# Altium schematic sheet STM32_F407.SchDoc
size A2
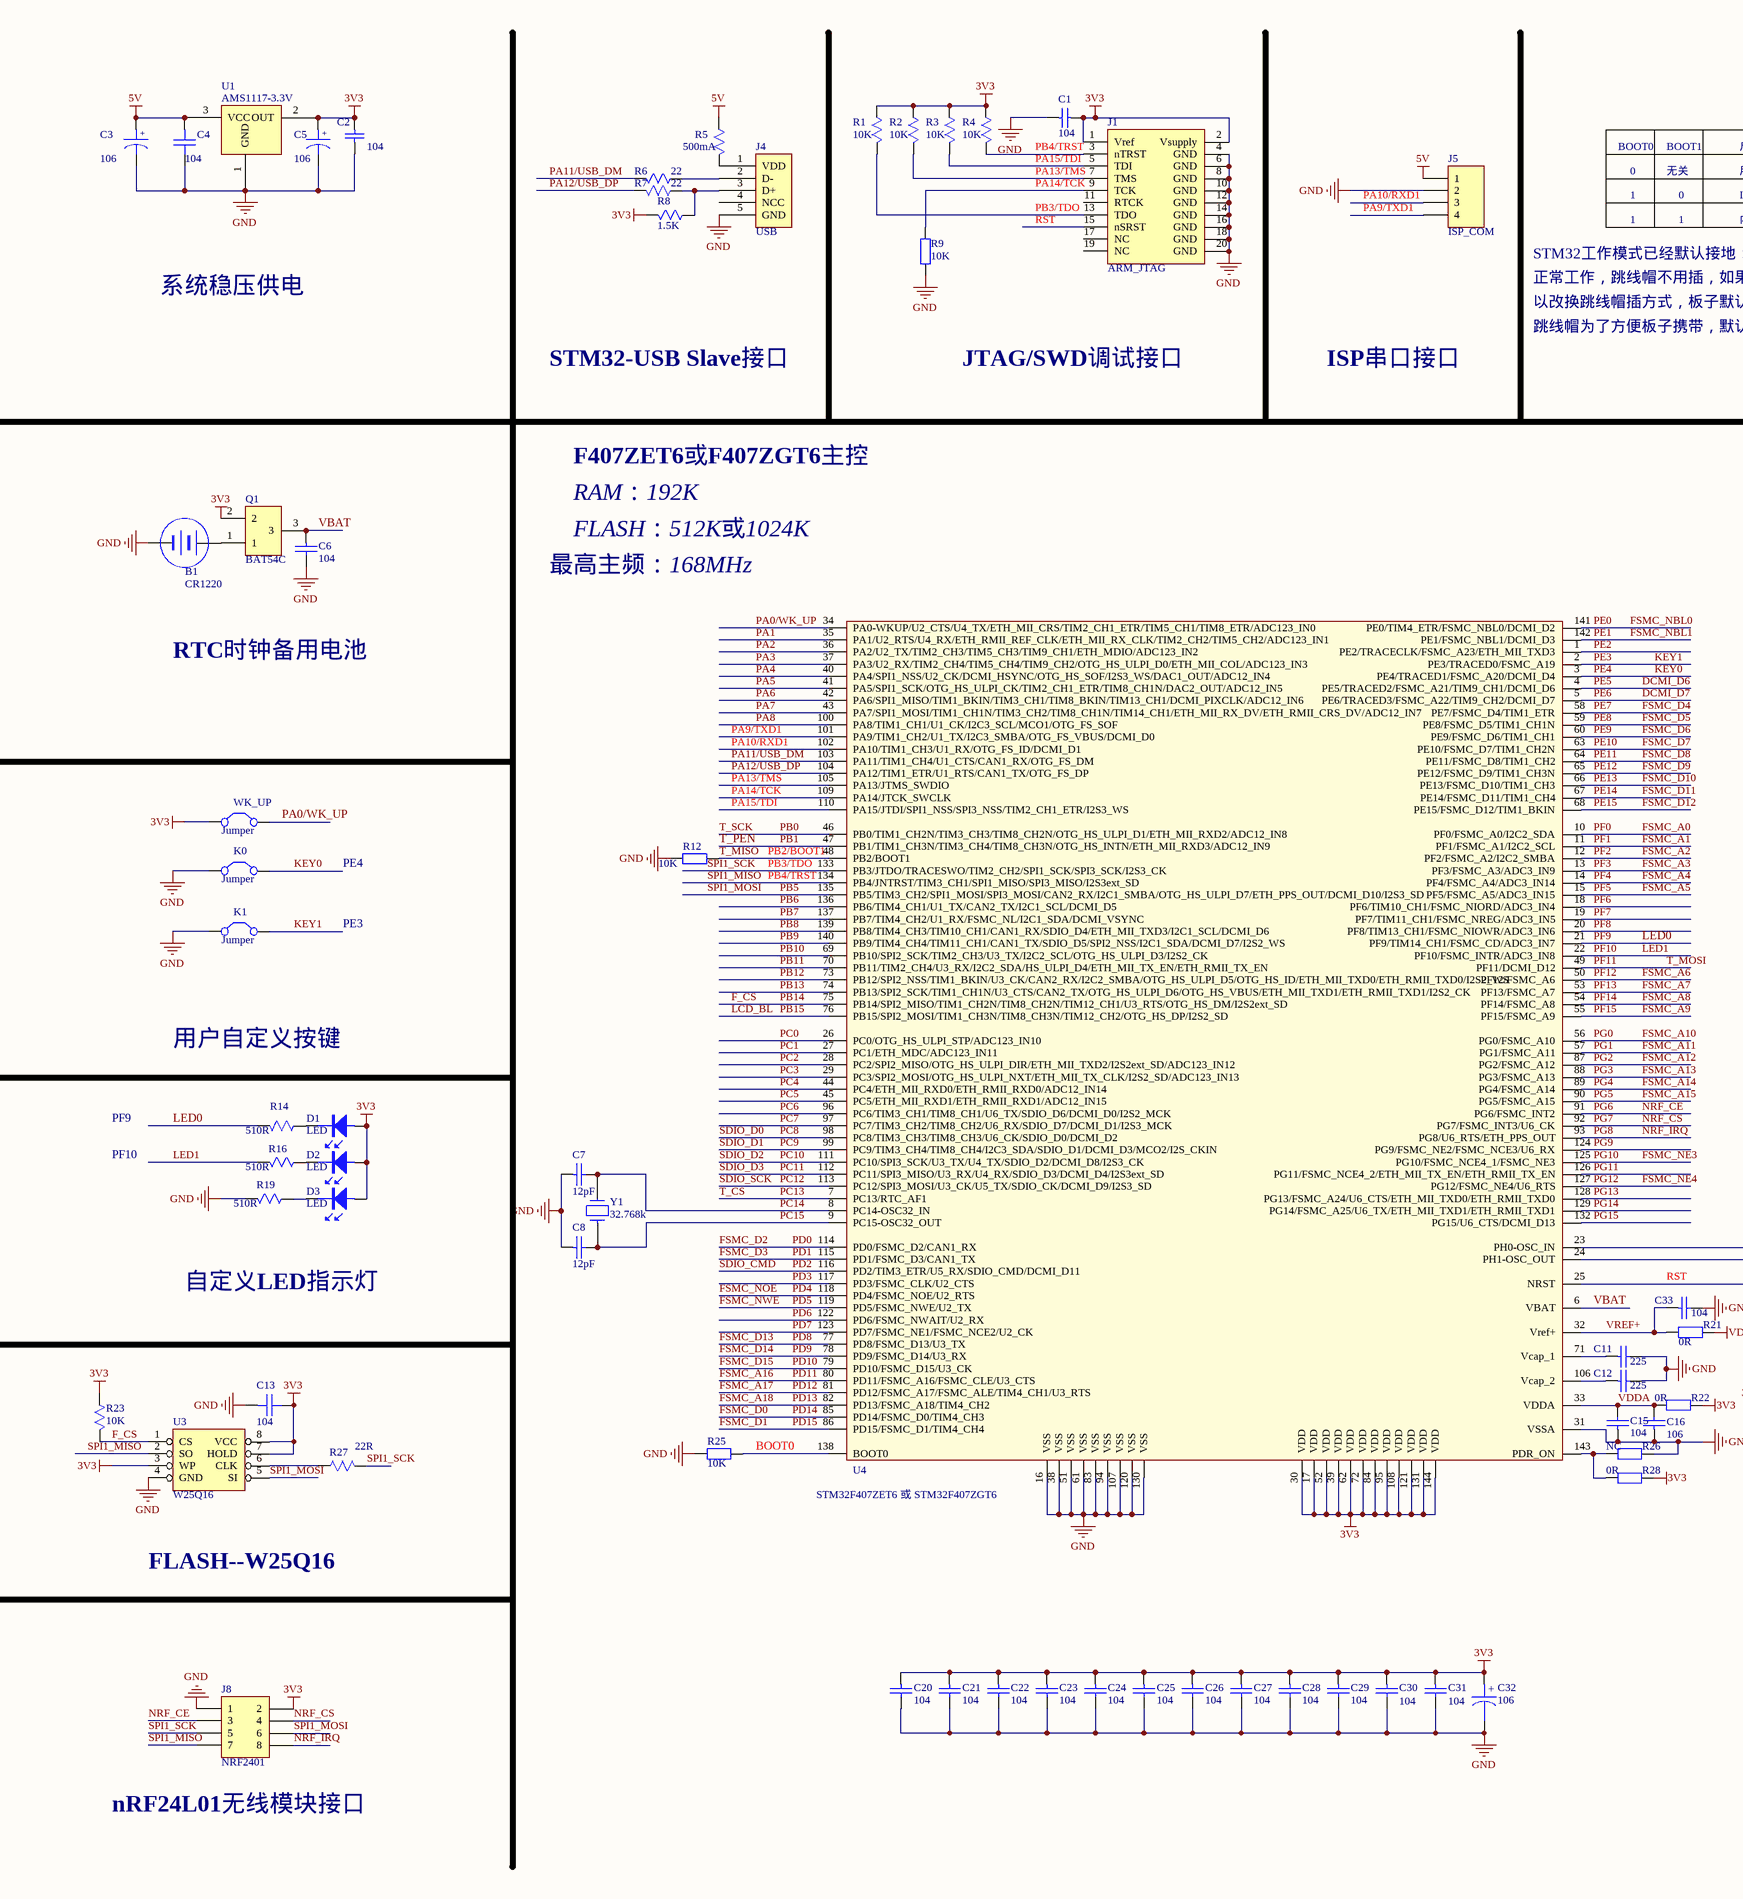
[diagram p0: STM32_F407.SchDoc, left]
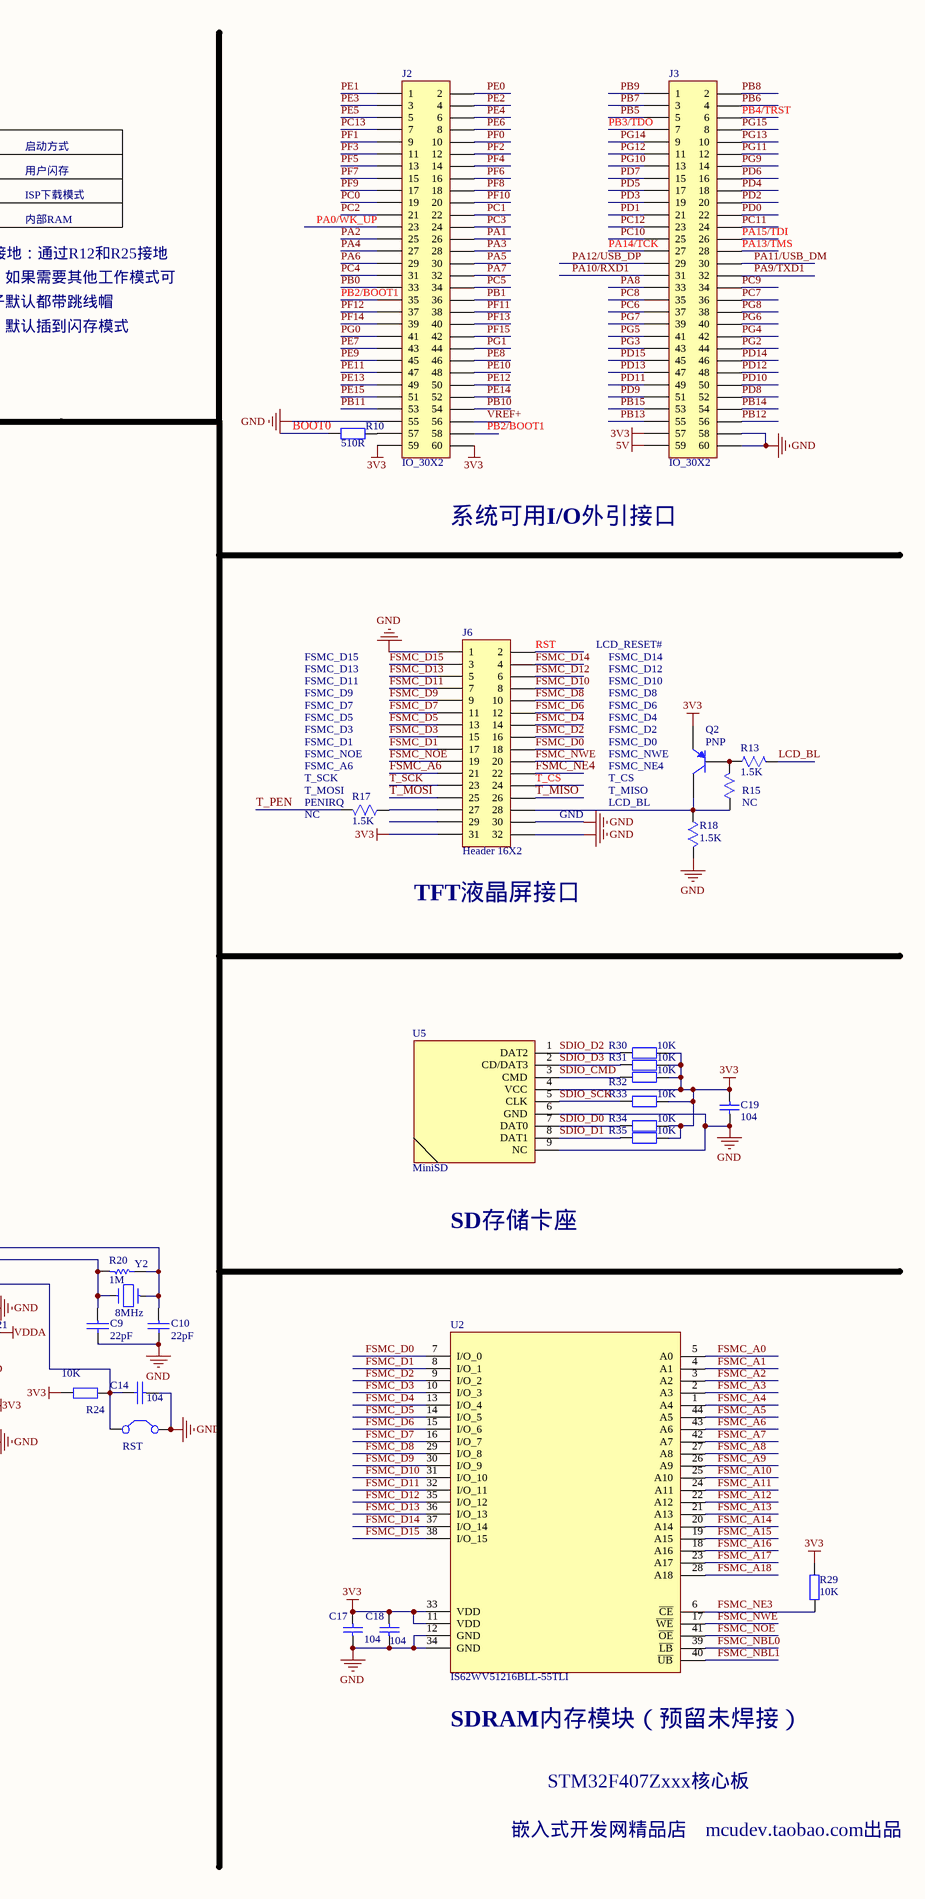
[diagram p1: STM32_F407.SchDoc, right]

## Parts
B1  CR1220  [CP1220]
C1  104  [RC0603]
C2  104  [RC0603]
C3  106  [RC0805]
C4  104  [RC0603]
C5  106  [RC0805]
C6  104  [RC0603]
C7  12pF  [RC0603]
C8  12pF  [RC0603]
C9  22pF  [RC0603]
C10  22pF  [RC0603]
C11  225  [RC0805]
C12  225  [RC0805]
C13  104  [RC0603]
C14  104  [RC0603]
C15  104  [RC0603]
C16  106  [RC0805]
C17  104  [RC0603]
C18  104  [RC0603]
C19  104  [RC0603]
C20  104  [RC0603]
C21  104  [RC0603]
C22  104  [RC0603]
C23  104  [RC0603]
C24  104  [RC0603]
C25  104  [RC0603]
C26  104  [RC0603]
C27  104  [RC0603]
C28  104  [RC0603]
C29  104  [RC0603]
C30  104  [RC0603]
C31  104  [RC0603]
C32  106  [RC0805]
C33  104  [RC0603]
D1  LED  [LED0805]
D2  LED  [LED0805]
D3  LED  [LED0805]
J1  ARM_JTAG  [JTAG20P]
J2  IO_30X2  [IDE2X30]
J3  IO_30X2  [IDE2X30]
J4  USB  [MINUSB]
J5  ISP_COM  [HDR1X4]
J6  Header 16X2  [IDE2X16-2.54]
J8  NRF2401  [DIP2X4-2.54]
K0  Jumper  [key]
K1  Jumper  [key]
Q1  BAT54C  [BAT54C]
Q2  PNP  [PNP_SOT23]
R1  10K  [RC0603]
R2  10K  [RC0603]
R3  10K  [RC0603]
R4  10K  [RC0603]
R5  500mA  [RC0805]
R6  22  [RC0603]
R7  22  [RC0603]
R8  1.5K  [RC0603]
R9  10K  [RC0603]
R10  510R  [RC0603]
R12  10K  [RC0603]
R13  1.5K  [RC0603]
R14  510R  [RC0603]
R15  NC  [RC0603]
R16  510R  [RC0603]
R17  1.5K  [RC0603]
R18  1.5K  [RC0603]
R19  510R  [RC0603]
R20  1M  [RC0603]
R21  0R  [RC0603]
R22  0R  [RC0603]
R23  10K  [RC0603]
R24  10K  [RC0603]
R25  10K  [RC0603]
R26  NC  [RC0603]
R27  22R  [RC0603]
R28  0R  [RC0603]
R29  10K  [RC0603]
R30  10K  [RC0603]
R31  10K  [RC0603]
R32  10K  [RC0603]
R33  10K  [RC0603]
R34  10K  [RC0603]
R35  10K  [RC0603]
RST  Key  [key]  (value not drawn)
U1  AMS1117-3.3V  [SOT223]
U2  IS62WV51216BLL-55TLI  [TSOP44]
U3  W25Q16  [SOIC8P]
U4  STM32F407ZET6 或 STM32F407ZGT6  [LQFP144N]
U5  MiniSD  [TF_SD]
WK_UP  Jumper  [key]
Y1  32.768k  [32.768k]
Y2  8MHz  [SMD49S]

## Nets
3V3: C1.2 C2.1 C5.1 C13.2 C17.2 C18.2 C19.1 C20.1 C21.1 C22.1 C23.1 C24.1 C25.1 C26.1 C27.1 C28.1 C29.1 C30.1 C31.1 C32.1 D1.1 D2.1 D3.1 J1.1(Vref) J1.2(Vsupply) J2.59 J2.60 J3.57 J6.31 J8.2 Q1.2 Q2.2(E) R1.1 R2.1 R3.1 R4.1 R8.2 R22.2 R23.1 R24.2 R28.2 R29.2 R30.2 R31.2 R32.2 R33.2 R34.2 R35.2 U1.2(OUT) U2.11(VDD) U2.33(VDD) U3.3(WP) U3.7(HOLD) U3.8(VCC) U4.17(VDD) U4.30(VDD) U4.39(VDD) U4.52(VDD) U4.62(VDD) U4.72(VDD) U4.84(VDD) U4.95(VDD) U4.108(VDD) U4.121(VDD) U4.131(VDD) U4.144(VDD) U5.4(VCC) WK_UP.1(C1)
5V: C3.1 C4.1 J3.59 J5.1 R5.1 U1.3(VCC)
GND: B1.2(-) C1.1 C2.2 C3.2 C4.2 C5.2 C6.2 C7.1 C8.1 C9.2 C10.2 C11.2 C12.2 C13.1 C14.1 C15.1 C16.1 C17.1 C18.1 C19.2 C20.2 C21.2 C22.2 C23.2 C24.2 C25.2 C26.2 C27.2 C28.2 C29.2 C30.2 C31.2 C32.2 C33.2 J1.4(GND) J1.6(GND) J1.8(GND) J1.10(GND) J1.12(GND) J1.14(GND) J1.16(GND) J1.18(GND) J1.20(GND) J2.55 J3.58 J3.60 J4.5(GND) J5.2 J6.1 J6.30 J6.32 J8.1 K0.1(C1) K1.1(C1) R9.1 R12.2 R18.2 R19.2 R25.2 R26.2 RST.2(C2) U1.1(GND) U2.12(GND) U2.34(GND) U3.4(GND) U4.16(VSS) U4.31(VSSA) U4.38(VSS) U4.51(VSS) U4.61(VSS) U4.83(VSS) U4.94(VSS) U4.107(VSS) U4.120(VSS) U4.130(VSS) U5.6(GND) U5.9(NC)
VDDA: C15.2 C16.2 R21.2 R22.1 U4.33(VDDA)
BOOT0: R10.2 R25.1 U4.138(BOOT0)
DCMI_D6: J2.5 U4.4(PE5/TRACED2/FSMC_A21/TIM9_CH1/DCMI_D6)  [also labelled PE5]
DCMI_D7: J2.8 U4.5(PE6/TRACED3/FSMC_A22/TIM9_CH2/DCMI_D7)  [also labelled PE6]
F_CS: J3.54 R23.2 U3.1(CS) U4.75(PB14/SPI2_MISO/TIM1_CH2N/TIM8_CH2N/TIM12_CH1/U3_RTS/OTG_HS_DM/I2S2ext_SD)  [also labelled PB14]
FSMC_A0: J2.10 U2.5(A0) U4.10(PF0/FSMC_A0/I2C2_SDA)  [also labelled PF0]
FSMC_A1: J2.9 U2.4(A1) U4.11(PF1/FSMC_A1/I2C2_SCL)  [also labelled PF1]
FSMC_A2: J2.12 U2.3(A2) U4.12(PF2/FSMC_A2/I2C2_SMBA)  [also labelled PF2]
FSMC_A3: J2.11 U2.2(A3) U4.13(PF3/FSMC_A3/ADC3_IN9)  [also labelled PF3]
FSMC_A4: J2.14 U2.1(A4) U4.14(PF4/FSMC_A4/ADC3_IN14)  [also labelled PF4]
FSMC_A5: J2.13 U2.44(A5) U4.15(PF5/FSMC_A5/ADC3_IN15)  [also labelled PF5]
FSMC_A6: J2.37 J6.21 U2.43(A6) U4.50(PF12/FSMC_A6)  [also labelled PF12]
FSMC_A7: J2.40 U2.42(A7) U4.53(PF13/FSMC_A7)  [also labelled PF13]
FSMC_A8: J2.39 U2.27(A8) U4.54(PF14/FSMC_A8)  [also labelled PF14]
FSMC_A9: J2.42 U2.26(A9) U4.55(PF15/FSMC_A9)  [also labelled PF15]
FSMC_A10: J2.41 U2.25(A10) U4.56(PG0/FSMC_A10)  [also labelled PG0]
FSMC_A11: J2.44 U2.24(A11) U4.57(PG1/FSMC_A11)  [also labelled PG1]
FSMC_A12: J3.44 U2.22(A12) U4.87(PG2/FSMC_A12)  [also labelled PG2]
FSMC_A13: J3.43 U2.21(A13) U4.88(PG3/FSMC_A13)  [also labelled PG3]
FSMC_A14: J3.42 U2.20(A14) U4.89(PG4/FSMC_A14)  [also labelled PG4]
FSMC_A15: J3.41 U2.19(A15) U4.90(PG5/FSMC_A15)  [also labelled PG5]
FSMC_A16: J3.49 U2.18(A16) U4.80(PD11/FSMC_A16/FSMC_CLE/U3_CTS)  [also labelled PD11]
FSMC_A17: J3.48 U2.23(A17) U4.81(PD12/FSMC_A17/FSMC_ALE/TIM4_CH1/U3_RTS)  [also labelled PD12]
FSMC_A18: J3.47 U2.28(A18) U4.82(PD13/FSMC_A18/TIM4_CH2)  [also labelled PD13]
FSMC_D0: J3.46 J6.18 U2.7(I/O_0) U4.85(PD14/FSMC_D0/TIM4_CH3)  [also labelled PD14]
FSMC_D1: J3.45 J6.17 U2.8(I/O_1) U4.86(PD15/FSMC_D1/TIM4_CH4)  [also labelled PD15]
FSMC_D2: J3.22 J6.16 U2.9(I/O_2) U4.114(PD0/FSMC_D2/CAN1_RX)  [also labelled PD0]
FSMC_D3: J3.21 J6.15 U2.10(I/O_3) U4.115(PD1/FSMC_D3/CAN1_TX)  [also labelled PD1]
FSMC_D4: J2.43 J6.14 U2.13(I/O_4) U4.58(PE7/FSMC_D4/TIM1_ETR)  [also labelled PE7]
FSMC_D5: J2.46 J6.13 U2.14(I/O_5) U4.59(PE8/FSMC_D5/TIM1_CH1N)  [also labelled PE8]
FSMC_D6: J2.45 J6.12 U2.15(I/O_6) U4.60(PE9/FSMC_D6/TIM1_CH1)  [also labelled PE9]
FSMC_D7: J2.48 J6.11 U2.16(I/O_7) U4.63(PE10/FSMC_D7/TIM1_CH2N)  [also labelled PE10]
FSMC_D8: J2.47 J6.10 U2.29(I/O_8) U4.64(PE11/FSMC_D8/TIM1_CH2)  [also labelled PE11]
FSMC_D9: J2.50 J6.9 U2.30(I/O_9) U4.65(PE12/FSMC_D9/TIM1_CH3N)  [also labelled PE12]
FSMC_D10: J2.49 J6.8 U2.31(I/O_10) U4.66(PE13/FSMC_D10/TIM1_CH3)  [also labelled PE13]
FSMC_D11: J2.52 J6.7 U2.32(I/O_11) U4.67(PE14/FSMC_D11/TIM1_CH4)  [also labelled PE14]
FSMC_D12: J2.51 J6.6 U2.35(I/O_12) U4.68(PE15/FSMC_D12/TIM1_BKIN)  [also labelled PE15]
FSMC_D13: J3.52 J6.5 U2.36(I/O_13) U4.77(PD8/FSMC_D13/U3_TX)  [also labelled PD8]
FSMC_D14: J3.51 J6.4 U2.37(I/O_14) U4.78(PD9/FSMC_D14/U3_RX)  [also labelled PD9]
FSMC_D15: J3.50 J6.3 U2.38(I/O_15) U4.79(PD10/FSMC_D15/U3_CK)  [also labelled PD10]
FSMC_NBL0: J2.2 U2.39(~{LB}) U4.141(PE0/TIM4_ETR/FSMC_NBL0/DCMI_D2)  [also labelled PE0]
FSMC_NBL1: J2.1 U2.40(~{UB}) U4.142(PE1/FSMC_NBL1/DCMI_D3)  [also labelled PE1]
FSMC_NE3: J3.13 R29.1 U2.6(~{CE}) U4.125(PG10/FSMC_NCE4_1/FSMC_NE3)  [also labelled PG10]
FSMC_NE4: J3.11 J6.22 U4.127(PG12/FSMC_NE4/U6_RTS)  [also labelled PG12]
FSMC_NOE: J3.18 J6.19 U2.41(~{OE}) U4.118(PD4/FSMC_NOE/U2_RTS)  [also labelled PD4]
FSMC_NWE: J3.17 J6.20 U2.17(~{WE}) U4.119(PD5/FSMC_NWE/U2_TX)  [also labelled PD5]
KEY0: J2.6 K0.2(C2) U4.3(PE4/TRACED1/FSMC_A20/DCMI_D4)  [also labelled PE4]
KEY1: J2.3 K1.2(C2) U4.2(PE3/TRACED0/FSMC_A19)  [also labelled PE3]
LCD_BL: J3.53 R13.2 U4.76(PB15/SPI2_MOSI/TIM1_CH3N/TIM8_CH3N/TIM12_CH2/OTG_HS_DP/I2S2_SD)  [also labelled PB15]
LED0: J2.17 R14.2 U4.21(PF9/TIM14_CH1/FSMC_CD/ADC3_IN7)  [also labelled PF9]
LED1: J2.20 R16.2 U4.22(PF10/FSMC_INTR/ADC3_IN8)  [also labelled PF10]
NRF_CE: J3.40 J8.3 U4.91(PG6/FSMC_INT2)  [also labelled PG6]
NRF_CS: J3.39 J8.4 U4.92(PG7/FSMC_INT3/U6_CK)  [also labelled PG7]
NRF_IRQ: J3.38 J8.8 U4.93(PG8/U6_RTS/ETH_PPS_OUT)  [also labelled PG8]
PA0/WK_UP: J2.23 U4.34(PA0-WKUP/U2_CTS/U4_TX/ETH_MII_CRS/TIM2_CH1_ETR/TIM5_CH1/TIM8_ETR/ADC123_IN0) WK_UP.2(C2)
PA1: J2.26 U4.35(PA1/U2_RTS/U4_RX/ETH_RMII_REF_CLK/ETH_MII_RX_CLK/TIM2_CH2/TIM5_CH2/ADC123_IN1)
PA2: J2.25 U4.36(PA2/U2_TX/TIM2_CH3/TIM5_CH3/TIM9_CH1/ETH_MDIO/ADC123_IN2)
PA3: J2.28 U4.37(PA3/U2_RX/TIM2_CH4/TIM5_CH4/TIM9_CH2/OTG_HS_ULPI_D0/ETH_MII_COL/ADC123_IN3)
PA4: J2.27 U4.40(PA4/SPI1_NSS/U2_CK/DCMI_HSYNC/OTG_HS_SOF/I2S3_WS/DAC1_OUT/ADC12_IN4)
PA5: J2.30 U4.41(PA5/SPI1_SCK/OTG_HS_ULPI_CK/TIM2_CH1_ETR/TIM8_CH1N/DAC2_OUT/ADC12_IN5)
PA6: J2.29 U4.42(PA6/SPI1_MISO/TIM1_BKIN/TIM3_CH1/TIM8_BKIN/TIM13_CH1/DCMI_PIXCLK/ADC12_IN6)
PA7: J2.32 U4.43(PA7/SPI1_MOSI/TIM1_CH1N/TIM3_CH2/TIM8_CH1N/TIM14_CH1/ETH_MII_RX_DV/ETH_RMII_CRS_DV/ADC12_IN7)
PA8: J3.33 U4.100(PA8/TIM1_CH1/U1_CK/I2C3_SCL/MCO1/OTG_FS_SOF)
PA9/TXD1: J3.32 J5.4 U4.101(PA9/TIM1_CH2/U1_TX/I2C3_SMBA/OTG_FS_VBUS/DCMI_D0)
PA10/RXD1: J3.31 J5.3 U4.102(PA10/TIM1_CH3/U1_RX/OTG_FS_ID/DCMI_D1)
PA11/USB_DM: J3.30 R6.2 U4.103(PA11/TIM1_CH4/U1_CTS/CAN1_RX/OTG_FS_DM)
PA12/USB_DP: J3.29 R7.2 U4.104(PA12/TIM1_ETR/U1_RTS/CAN1_TX/OTG_FS_DP)
PA13/TMS: J1.7(TMS) J3.28 R2.2 U4.105(PA13/JTMS_SWDIO)
PA14/TCK: J1.9(TCK) J3.27 R9.2 U4.109(PA14/JTCK_SWCLK)
PA15/TDI: J1.5(TDI) J3.26 R3.2 U4.110(PA15/JTDI/SPI1_NSS/SPI3_NSS/TIM2_CH1_ETR/I2S3_WS)
PB0: J2.33 J6.23 U4.46(PB0/TIM1_CH2N/TIM3_CH3/TIM8_CH2N/OTG_HS_ULPI_D1/ETH_MII_RXD2/ADC12_IN8)  [also labelled T_SCK]
PB1: J2.36 R17.2 U4.47(PB1/TIM1_CH3N/TIM3_CH4/TIM8_CH3N/OTG_HS_INTN/ETH_MII_RXD3/ADC12_IN9)  [also labelled T_PEN]
PB2/BOOT1: J2.35 J2.58 J6.26 R12.1 U4.48(PB2/BOOT1)  [also labelled T_MISO]
PB3/TDO: J1.13(TDO) J3.7 J8.5 R1.2 R27.2 U4.133(PB3/JTDO/TRACESWO/TIM2_CH2/SPI1_SCK/SPI3_SCK/I2S3_CK)  [also labelled SPI1_SCK]
PB4/TRST: J1.3(nTRST) J3.6 J8.7 R4.2 U3.2(SO) U4.134(PB4/JNTRST/TIM3_CH1/SPI1_MISO/SPI3_MISO/I2S3ext_SD)  [also labelled SPI1_MISO]
PB5: J3.5 J8.6 U3.5(SI) U4.135(PB5/TIM3_CH2/SPI1_MOSI/SPI3_MOSI/CAN2_RX/I2C1_SMBA/OTG_HS_ULPI_D7/ETH_PPS_OUT/DCMI_D10/I2S3_SD)  [also labelled SPI1_MOSI]
PB6: J3.4 U4.136(PB6/TIM4_CH1/U1_TX/CAN2_TX/I2C1_SCL/DCMI_D5)
PB7: J3.3 U4.137(PB7/TIM4_CH2/U1_RX/FSMC_NL/I2C1_SDA/DCMI_VSYNC)
PB8: J3.2 U4.139(PB8/TIM4_CH3/TIM10_CH1/CAN1_RX/SDIO_D4/ETH_MII_TXD3/I2C1_SCL/DCMI_D6)
PB9: J3.1 U4.140(PB9/TIM4_CH4/TIM11_CH1/CAN1_TX/SDIO_D5/SPI2_NSS/I2C1_SDA/DCMI_D7/I2S2_WS)
PB10: J2.54 U4.69(PB10/SPI2_SCK/TIM2_CH3/U3_TX/I2C2_SCL/OTG_HS_ULPI_D3/I2S2_CK)
PB11: J2.53 U4.70(PB11/TIM2_CH4/U3_RX/I2C2_SDA/HS_ULPI_D4/ETH_MII_TX_EN/ETH_RMII_TX_EN)
PB12: J3.56 U4.73(PB12/SPI2_NSS/TIM1_BKIN/U3_CK/CAN2_RX/I2C2_SMBA/OTG_HS_ULPI_D5/OTG_HS_ID/ETH_MII_TXD0/ETH_RMII_TXD0/I2S2_WS)
PB13: J3.55 U4.74(PB13/SPI2_SCK/TIM1_CH1N/U3_CTS/CAN2_TX/OTG_HS_ULPI_D6/OTG_HS_VBUS/ETH_MII_TXD1/ETH_RMII_TXD1/I2S2_CK)
PC0: J2.19 U4.26(PC0/OTG_HS_ULPI_STP/ADC123_IN10)
PC1: J2.22 U4.27(PC1/ETH_MDC/ADC123_IN11)
PC2: J2.21 U4.28(PC2/SPI2_MISO/OTG_HS_ULPI_DIR/ETH_MII_TXD2/I2S2ext_SD/ADC123_IN12)
PC3: J2.24 U4.29(PC3/SPI2_MOSI/OTG_HS_ULPI_NXT/ETH_MII_TX_CLK/I2S2_SD/ADC123_IN13)
PC4: J2.31 U4.44(PC4/ETH_MII_RXD0/ETH_RMII_RXD0/ADC12_IN14)
PC5: J2.34 U4.45(PC5/ETH_MII_RXD1/ETH_RMII_RXD1/ADC12_IN15)
PC6: J3.37 U4.96(PC6/TIM3_CH1/TIM8_CH1/U6_TX/SDIO_D6/DCMI_D0/I2S2_MCK)
PC7: J3.36 U4.97(PC7/TIM3_CH2/TIM8_CH2/U6_RX/SDIO_D7/DCMI_D1/I2S3_MCK)
PC8: J3.35 R34.1 U4.98(PC8/TIM3_CH3/TIM8_CH3/U6_CK/SDIO_D0/DCMI_D2) U5.7(DAT0)  [also labelled SDIO_D0]
PC9: J3.34 R35.1 U4.99(PC9/TIM3_CH4/TIM8_CH4/I2C3_SDA/SDIO_D1/DCMI_D3/MCO2/I2S_CKIN) U5.8(DAT1)  [also labelled SDIO_D1]
PC10: J3.25 R30.1 U4.111(PC10/SPI3_SCK/U3_TX/U4_TX/SDIO_D2/DCMI_D8/I2S3_CK) U5.1(DAT2)  [also labelled SDIO_D2]
PC11: J3.24 R31.1 U4.112(PC11/SPI3_MISO/U3_RX/U4_RX/SDIO_D3/DCMI_D4/I2S3ext_SD) U5.2(CD/DAT3)  [also labelled SDIO_D3]
PC12: J3.23 R33.1 U4.113(PC12/SPI3_MOSI/U3_CK/U5_TX/SDIO_CK/DCMI_D9/I2S3_SD) U5.5(CLK)  [also labelled SDIO_SCK]
PC13: J2.7 J6.24 U4.7(PC13/RTC_AF1)  [also labelled T_CS]
PC14: C7.2 U4.8(PC14-OSC32_IN) Y1.2
PC15: C8.2 U4.9(PC15-OSC32_OUT) Y1.1
PD2: J3.20 R32.1 U4.116(PD2/TIM3_ETR/U5_RX/SDIO_CMD/DCMI_D11) U5.3(CMD)  [also labelled SDIO_CMD]
PD3: J3.19 U4.117(PD3/FSMC_CLK/U2_CTS)
PD6: J3.16 U4.122(PD6/FSMC_NWAIT/U2_RX)
PD7: J3.15 U4.123(PD7/FSMC_NE1/FSMC_NCE2/U2_CK)
PE2: J2.4 U4.1(PE2/TRACECLK/FSMC_A23/ETH_MII_TXD3)
PF6: J2.16 U4.18(PF6/TIM10_CH1/FSMC_NIORD/ADC3_IN4)
PF7: J2.15 U4.19(PF7/TIM11_CH1/FSMC_NREG/ADC3_IN5)
PF8: J2.18 U4.20(PF8/TIM13_CH1/FSMC_NIOWR/ADC3_IN6)
PF11: J2.38 J6.25 U4.49(PF11/DCMI_D12)  [also labelled T_MOSI]
PG9: J3.14 U4.124(PG9/FSMC_NE2/FSMC_NCE3/U6_RX)
PG11: J3.12 U4.126(PG11/FSMC_NCE4_2/ETH_MII_TX_EN/ETH_RMII_TX_EN)
PG13: J3.10 U4.128(PG13/FSMC_A24/U6_CTS/ETH_MII_TXD0/ETH_RMII_TXD0)
PG14: J3.9 U4.129(PG14/FSMC_A25/U6_TX/ETH_MII_TXD1/ETH_RMII_TXD1)
PG15: J3.8 U4.132(PG15/U6_CTS/DCMI_D13)
RST: C14.2 J1.15(nSRST) J6.2 R24.1 RST.1(C1) U4.25(NRST)
VBAT: C6.1 Q1.3 U4.6(VBAT)
VREF+: C33.1 J2.56 R21.1 U4.32(Vref+)
NetB1_1: B1.1(+) Q1.1
NetC9_1: C9.1 R20.2 U4.24(PH1-OSC_OUT) Y2.2
NetC10_1: C10.1 R20.1 U4.23(PH0-OSC_IN) Y2.1
NetC11_1: C11.1 U4.71(Vcap_1)
NetC12_1: C12.1 U4.106(Vcap_2)
NetD1_2: D1.2 R14.1
NetD2_2: D2.2 R16.1
NetD3_2: D3.2 R19.1
NetJ2_57: J2.57 R10.1
NetJ4_1: J4.1(VDD) R5.2
NetJ4_2: J4.2(D-) R6.1
NetJ4_3: J4.3(D+) R7.1 R8.1
NetJ6_27: J6.27 R17.1
NetJ6_28: J6.28 Q2.3(C) R15.1 R18.1
NetQ2_1: Q2.1(B) R13.1 R15.2
NetR26_1: R26.1 R28.1 U4.143(PDR_ON)
NetR27_1: R27.1 U3.6(CLK)

Not connected (* = marked no-connect by the designer): J1 11(RTCK) 17(NC) 19(NC); J4 4(NCC); J6 29

## Notes on the sheet
- BOOT0
- BOOT1
- 启动方式
- 0
- 1
- 无关
- 用户闪存
- ISP下载模式
- 内部RAM
- STM32工作模式已经默认接地：通过R12和R25接地
- 正常工作，跳线帽不用插，如果需要其他工作模式可
- 系统稳压供电
- 以改换跳线帽插方式，板子默认都带跳线帽
- 跳线帽为了方便板子携带，默认插到闪存模式
- STM32-USB Slave接口
- JTAG/SWD调试接口
- ISP串口接口
- F407ZET6或F407ZGT6主控
- RAM：192K
- 系统可用I/O外引接口
- 最高主频：168MHz
- FLASH：512K或1024K
- LCD_RESET#
- RTC时钟备用电池
- FSMC_D7
- FSMC_D9
- FSMC_D11
- FSMC_D13
- FSMC_D15
- FSMC_D6
- FSMC_D8
- FSMC_D10
- FSMC_D12
- FSMC_D14
- FSMC_NOE
- (near R17) FSMC_A6
- FSMC_D1
- FSMC_D3
- FSMC_D5
- FSMC_NE4
- (near Q2) FSMC_NWE
- (near Q2) FSMC_D0
- (near Q2) FSMC_D2
- FSMC_D4
- (near R17) NC
- (near R17) T_MOSI
- (near R17) PENIRQ
- (near R17) T_SCK
- GND
- T_MISO
- T_CS
- LCD_BL
- PE4
- PE3
- (near J6) TFT液晶屏接口
- 用户自定义按键
- PF9
- PF10
- SD存储卡座
- 自定义LED指示灯
- FLASH--W25Q16
- (near U2) SDRAM内存模块（预留未焊接）
- STM32F407Zxxx核心板
- (near J8) nRF24L01无线模块接口
- 嵌入式开发网精品店
- mcudev.taobao.com出品
- (in symbol CAP2) +
- (in symbol CAPACITOR POL) +

## Library data of the parts
B1 = BATTERY
C1 C2 C17 C18 = Cap: Capacitor; Published: 8-Jun-2000; LatestRevisionDate: 17-Jul-2002; LatestRevisionNote: Re-released for DXP Platform.; PackageReference: RAD-0.3; Publisher: Altium Limited
C3 C5 = CAP2
C4 C13 = CAP
C6-C12 C14-C16 C20-C31 C33 = CAP: Capcitor
C19 = Cap Semi: Capacitor (Semiconductor SIM Model); Published: 8-Jun-2000; Revision: July-2002: Re-released for DXP Platform.; Publisher: Altium Limited
C32 = CAPACITOR POL: Capacitor
J1 = JTAG
J2 J3 = Header 30X2: Header, 30-Pin, Dual row; LatestRevisionDate: 17-Jul-2002; LatestRevisionNote: Re-released for DXP Platform.; Publisher: Altium Limited
J5 = Header 4: Header, 4-Pin; LatestRevisionDate: 17-Jul-2002; LatestRevisionNote: Re-released for DXP Platform.; Publisher: Altium Limited
J6 = Header 16X2: Header, 16-Pin, Dual row; LatestRevisionDate: 17-Jul-2002; LatestRevisionNote: Re-released for DXP Platform.; Publisher: Altium Limited
J8 = Header 4X2: Header, 4-Pin, Dual row; LatestRevisionDate: 17-Jul-2002; LatestRevisionNote: Re-released for DXP Platform.; Publisher: Altium Limited
K0 K1 RST WK_UP = Jumper: Jumper Wire; Published: 24-Mar-1999; LatestRevisionDate: 17-Jul-2002; LatestRevisionNote: Re-released for DXP Platform.; PackageReference: RAD-0.2; Publisher: Altium Limited
Q2 = PNP: PNP Bipolar Transistor; Published: 8-Jun-2000; LatestRevisionDate: 29-May-2009; LatestRevisionNote: IPC-7351 Footprint Added.; PackageVersion: Aug-1999; PackageReference: SOT-23B; Publisher: Altium Limited; PackageDescription: 3-Pin SOT-23 Package 0.95 mm Pitch, 2.4 mm Lead Span
R1-R8 R13-R19 R23 R27 = RES
R9 R10 R12 R21 R22 R24-R26 R28-R35 = Res2: Resistor
R20 = Res1: Resistor; Value: 1M
U1 = 11
U3 = W25X16
U4 = STM32F407ZET6
Y1 = CRYSTAL: Crystal 8MHz PLUG; Value: 8MHz
Y2 = XTAL: Crystal Oscillator